# EAGLE design 3transistor (EAGLE 6.6.0)
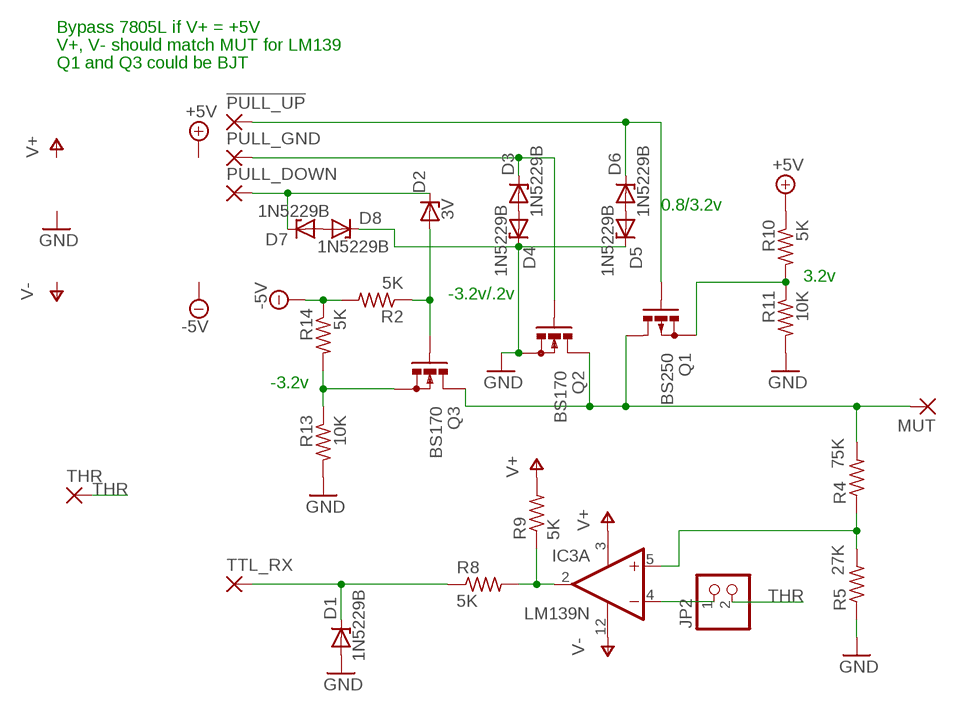
[diagram p0: schematic, sheet 1]

## Parts
!PULL_UP  1,6/0,9  [1,6/0,9]
D1  1N5229B  ZENER-DIODEZD-2.5  [ZDIO-2.5]
D2  3V  ZENER-DIODEZD-2.5  [ZDIO-2.5]
D3  1N5229B  ZENER-DIODEZD-2.5  [ZDIO-2.5]
D4  1N5229B  ZENER-DIODEZD-2.5  [ZDIO-2.5]
D5  1N5229B  ZENER-DIODEZD-2.5  [ZDIO-2.5]
D6  1N5229B  ZENER-DIODEZD-2.5  [ZDIO-2.5]
D7  1N5229B  ZENER-DIODEZD-2.5  [ZDIO-2.5]
D8  1N5229B  ZENER-DIODEZD-2.5  [ZDIO-2.5]
IC3  LM139N  LM339N  [DIL14]
JP2  PINHD-1X2  [1X02]
MUT  1,6/0,9  [1,6/0,9]
PULL_DOWN  1,6/0,9  [1,6/0,9]
PULL_GND  1,6/0,9  [1,6/0,9]
Q1  BS250  [SOT54E]
Q2  BS170  [SOT54E]
Q3  BS170  [SOT54E]
R2  5K  R-US_0207/2V  [0207/2V]
R4  75K  R-US_0207/2V  [0207/2V]
R5  27K  R-US_0207/2V  [0207/2V]
R8  5K  R-US_0207/2V  [0207/2V]
R9  5K  R-US_0207/2V  [0207/2V]
R10  5K  R-US_0207/2V  [0207/2V]
R11  10K  R-US_0207/2V  [0207/2V]
R13  10K  R-US_0207/2V  [0207/2V]
R14  5K  R-US_0207/2V  [0207/2V]
THR  1,6/0,9  [1,6/0,9]
TTL_RX  1,6/0,9  [1,6/0,9]

## Nets
+5V: R10.1
-5V: R2.2 R14.1
GND: D1.A D4.C D5.C D8.C Q2.S R5.1 R11.2 R13.2
N$1: MUT.1(P) Q1.D Q2.D Q3.D R4.2
N$2: D2.A Q3.G R2.1
N$3: D3.C PULL_GND.1(P) Q2.G
N$4: D2.C D7.C PULL_DOWN.1(P)
N$5: Q1.S R10.2 R11.1
N$6: D5.A D6.A
N$7: IC3.5(A:+IN) R4.1 R5.2
N$8: IC3.4(A:-IN) JP2.1
N$9: IC3.2(A:OUT) R8.2 R9.1
N$10: !PULL_UP.1(P) D6.C Q1.G
N$11: D3.A D4.A
N$12: D1.C R8.1 TTL_RX.1(P)
N$15: D7.A D8.A
N$16: Q3.S R13.1 R14.2
THR: JP2.2 THR.1(P)
V+: IC3.3(P:V+) R9.2
V-: IC3.12(P:GND)
Unconnected: IC3.1(B:OUT) IC3.6(B:-IN) IC3.7(B:+IN) IC3.8(C:-IN) IC3.9(C:+IN) IC3.10(D:-IN) IC3.11(D:+IN) IC3.13(D:OUT) IC3.14(C:OUT)

## Notes on the sheet
- Bypass 7805L if V+ = +5V
- V+, V- should match MUT for LM139
- Q1 and Q3 could be BJT
- 0.8/3.2v
- 3.2v
- -3.2v/.2v
- -3.2v

## Library data of the parts
!PULL_UP MUT PULL_DOWN PULL_GND THR TTL_RX = wirepad:1,6/0,9: THROUGH-HOLE PAD
D1-D8 = diode:ZENER-DIODE: Z-Diode
IC3 = linear:LM339: Low Power Low Offset Voltage Quad Comparators with open collector; LM139/LM239/LM339/LM2901/LM3302
JP2 = pinhead:PINHD-1X2: PIN HEADER
Q1 = transistor-small-signal:BS250: P-CHANNEL MOS FET
Q2 Q3 = transistor-small-signal:BS170: N-CHANNEL MOS FET
R2 R4 R5 R8-R11 R13 R14 = rcl:R-US_: RESISTOR, American symbol

## Board
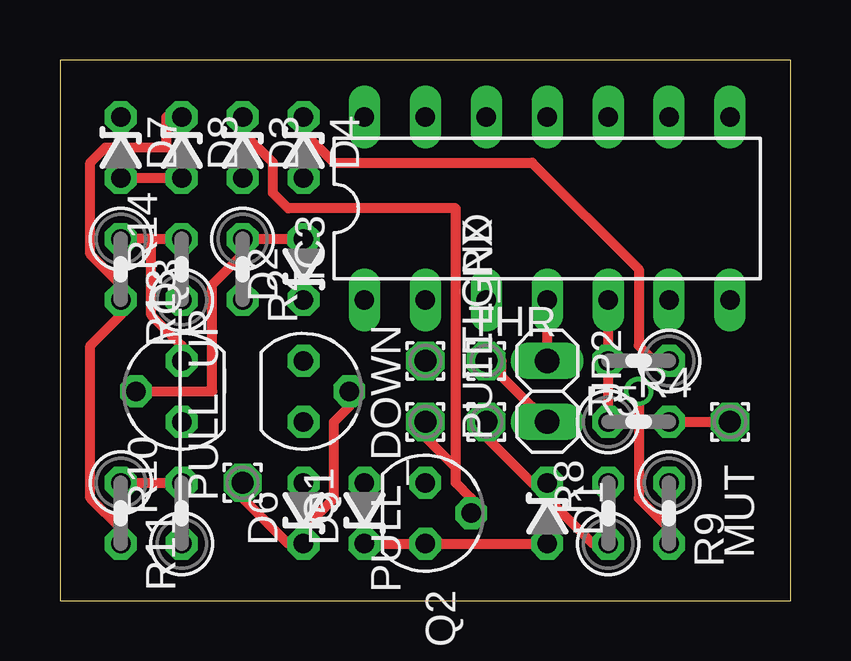
[diagram p1: board, top side]
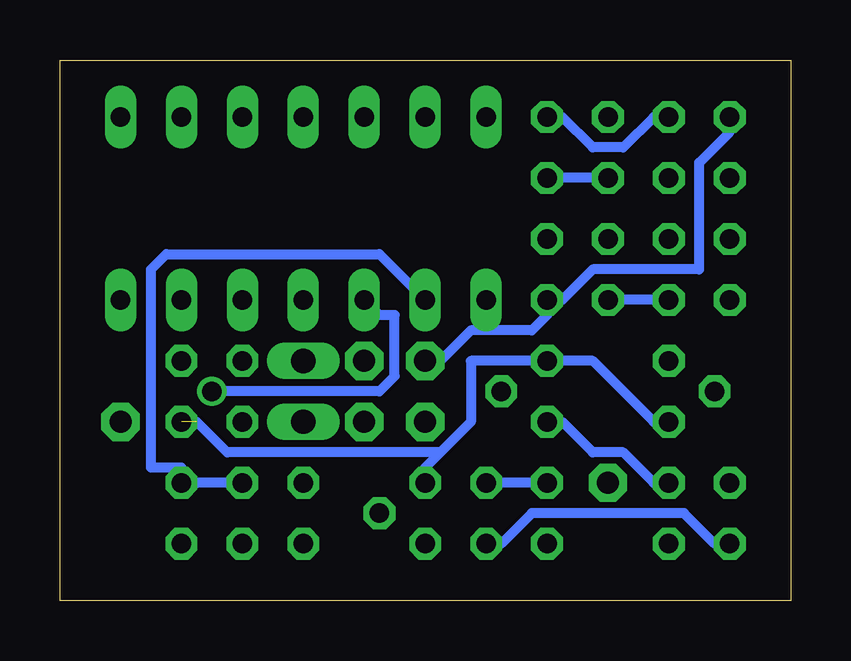
[diagram p2: board, bottom side, seen from below]

Size 30.46 x 22.53 mm. Coordinates in mm from the lower left corner, seen from the top.
Outline: 0,0 30.46,0 30.46,22.53 0,22.53 0,0
Copper layers (1+16): Top 0.035mm / dielectric 1.5mm / Bottom 0.035mm
Design rules "16mils": minimum track width 16mil, minimum drill 32mil, track to track 15mil, track to pad 10mil, pad to pad 10mil, via to via 10mil, smd to smd 10mil, copper to edge 13mil, drill to drill 10mil, minimum pad ring 10mil, minimum via ring 8mil, stop-mask expansion 0mil, vias tented up to drill 0mil, thermal gap 10mil

### Footprints (pad centres in the part's own frame; a part is rotated, then mirrored left to right if it is on the bottom)
1,6/0,9 = drill 0.914 pad 1.6 octagon: 1 0,0
ZDIO-2.5 = drill 0.813 octagon: A 1.27,0; C -1.27,0
DIL14 = drill 0.813 long: 1 -7.62,-3.81; 2 -5.08,-3.81; 3 -2.54,-3.81; 4 0,-3.81; 5 2.54,-3.81; 6 5.08,-3.81; 7 7.62,-3.81; 8 7.62,3.81; 9 5.08,3.81; 10 2.54,3.81; 11 0,3.81; 12 -2.54,3.81; 13 -5.08,3.81; 14 -7.62,3.81
1X02 = drill 1.016 long: 1 -1.27,0; 2 1.27,0
SOT54E = drill 0.813 octagon: D -1.27,0; G 0,1.905; S 1.27,0
0207/2V = drill 0.813 octagon: 1 -1.27,0; 2 1.27,0

### Placement (x,y rotation side)
!PULL_UP  7.62,4.92 90 top
D1  20.32,3.65 270 top
D2  10.15,13.81 90 top
D3  7.62,18.89 270 top
D4  10.15,18.89 270 top
D5  12.69,3.65 90 top
D6  10.15,3.65 90 top
D7  2.54,18.89 270 top
D8  5.08,18.89 270 top
IC3  20.32,16.35 0 top
JP2  20.32,8.73 270 top
MUT  27.94,7.46 270 top
PULL_DOWN  15.23,10 270 top
PULL_GND  15.23,7.46 0 top
Q1  10.15,8.73 270 top
Q2  15.23,3.65 270 top
Q3  5.08,8.73 90 top
R2  7.62,13.81 270 top
R4  24.12,7.46 0 top
R5  24.12,10 180 top
R8  22.86,3.65 90 top
R9  25.39,3.65 270 top
R10  5.08,3.65 90 top
R11  2.54,3.65 270 top
R13  2.54,13.81 270 top
R14  5.08,13.81 90 top
THR  17.78,10 0 top
TTL_RX  17.78,7.46 90 top

### Tracks (layer width: path | path; a pad name or v marks a point on that pad's centre or on a via)
-5V
  Bottom 0.406: R14.1 5.71,12.54 6.98,12.54 R2.2
GND
  Top 0.406: D5.C 13.33,2.38 14.6,2.38 Q2.S 15.87,2.38 19.68,2.38 D1.A | R11.2 2.54,3.01 1.27,4.28 1.27,10.63 2.54,11.9 R13.2 2.54,13.17 1.27,14.44 1.27,18.25 1.9,18.89 4.44,18.89 4.44,20.16 D8.C | R5.1 24.76,10 24.12,10.63 24.12,13.81 19.68,18.25 11.42,18.25 10.15,19.52 D4.C
  Bottom 0.406: R11.2 3.17,2.38 4.44,3.65 10.79,3.65 12.06,2.38 D5.C | D8.C 5.71,20.16 6.98,18.89 8.25,18.89 9.52,20.16 D4.C
N$1  (1 unrouted)
  Top 0.406: R4.2 26.03,7.46 27.3,7.46 MUT.1
  Bottom 0.406: 14.6,6.18 13.33,7.46 13.33,10 10.79,10 Q1.D 9.52,10 8.25,10 5.71,7.46 Q3.D | 14.6,6.18 15.23,5.55 Q2.D | 24.76,7.46 23.49,6.18 14.6,6.18
N$2
  Top 0.406: Q3.G 3.81,8.73 6.34,8.73 6.34,13.17 7.62,14.44 R2.1 8.25,15.08 9.52,15.08 D2.A
N$3
  Top 0.406: 16.51,5.55 16.51,4.92 17.14,4.28 Q2.G | 16.51,5.55 15.23,6.82 PULL_GND.1 | 16.51,5.55 16.51,16.35 9.52,16.35 8.88,16.98 8.88,18.25 7.62,19.52 D3.C
N$4
  Bottom 0.406: D7.C 2.54,19.52 3.81,18.25 3.81,13.81 8.25,13.81 9.52,12.54 D2.C 10.15,11.9 10.79,11.27 13.33,11.27 14.6,10 PULL_DOWN.1
N$5
  Top 0.406: R11.1 3.17,4.92 4.44,4.92 R10.2
  Bottom 0.406: Q1.S 9.52,7.46 8.25,6.18 6.98,6.18 5.71,4.92 R10.2
N$6
  Bottom 0.406: D6.A 10.79,4.92 12.06,4.92 D5.A
N$7
  Top 0.406: R4.1 22.86,8.09 22.86,9.36 R5.2 22.86,10.63 22.86,11.27 IC3.5
N$8
  Top 0.406: IC3.4 20.32,11.27 20.32,10.63 JP2.1
N$9
  Bottom 0.406: R8.2 23.49,4.92 24.76,4.92 R9.1 25.39,5.55 26.67,5.55 26.67,13.81 26.03,14.44 17.14,14.44 15.87,13.17 IC3.2
N$10
  Top 0.406: !PULL_UP.1 7.62,4.28 9.52,2.38 D6.C 10.15,3.01 11.42,4.28 11.42,7.46 12.06,8.09 Q1.G
N$11
  Bottom 0.406: D3.A 8.25,17.62 9.52,17.62 D4.A
N$12
  Top 0.406: R8.1 22.22,2.38 20.32,4.28 D1.C 19.68,4.92 17.78,6.82 TTL_RX.1
N$15
  Top 0.406: D7.A 3.17,17.62 4.44,17.62 D8.A
N$16
  Top 0.406: 3.81,15.08 4.44,15.08 R14.2 | 3.81,15.08 3.17,15.08 R13.1 | 3.81,15.08 3.81,11.9 5.08,10.63 Q3.S
THR
  Top 0.406: JP2.2 19.68,8.09 18.41,9.36 18.41,10 THR.1
V+  (via drill 0.81)
  Top 0.406: v24.12,8.73 24.12,4.28 25.39,3.01 R9.2
  Bottom 0.406: v24.12,8.73 17.14,8.73 16.51,9.36 16.51,11.9 17.14,11.9 IC3.3